# EAGLE design SkweezeeBit (EAGLE 9.5.2)
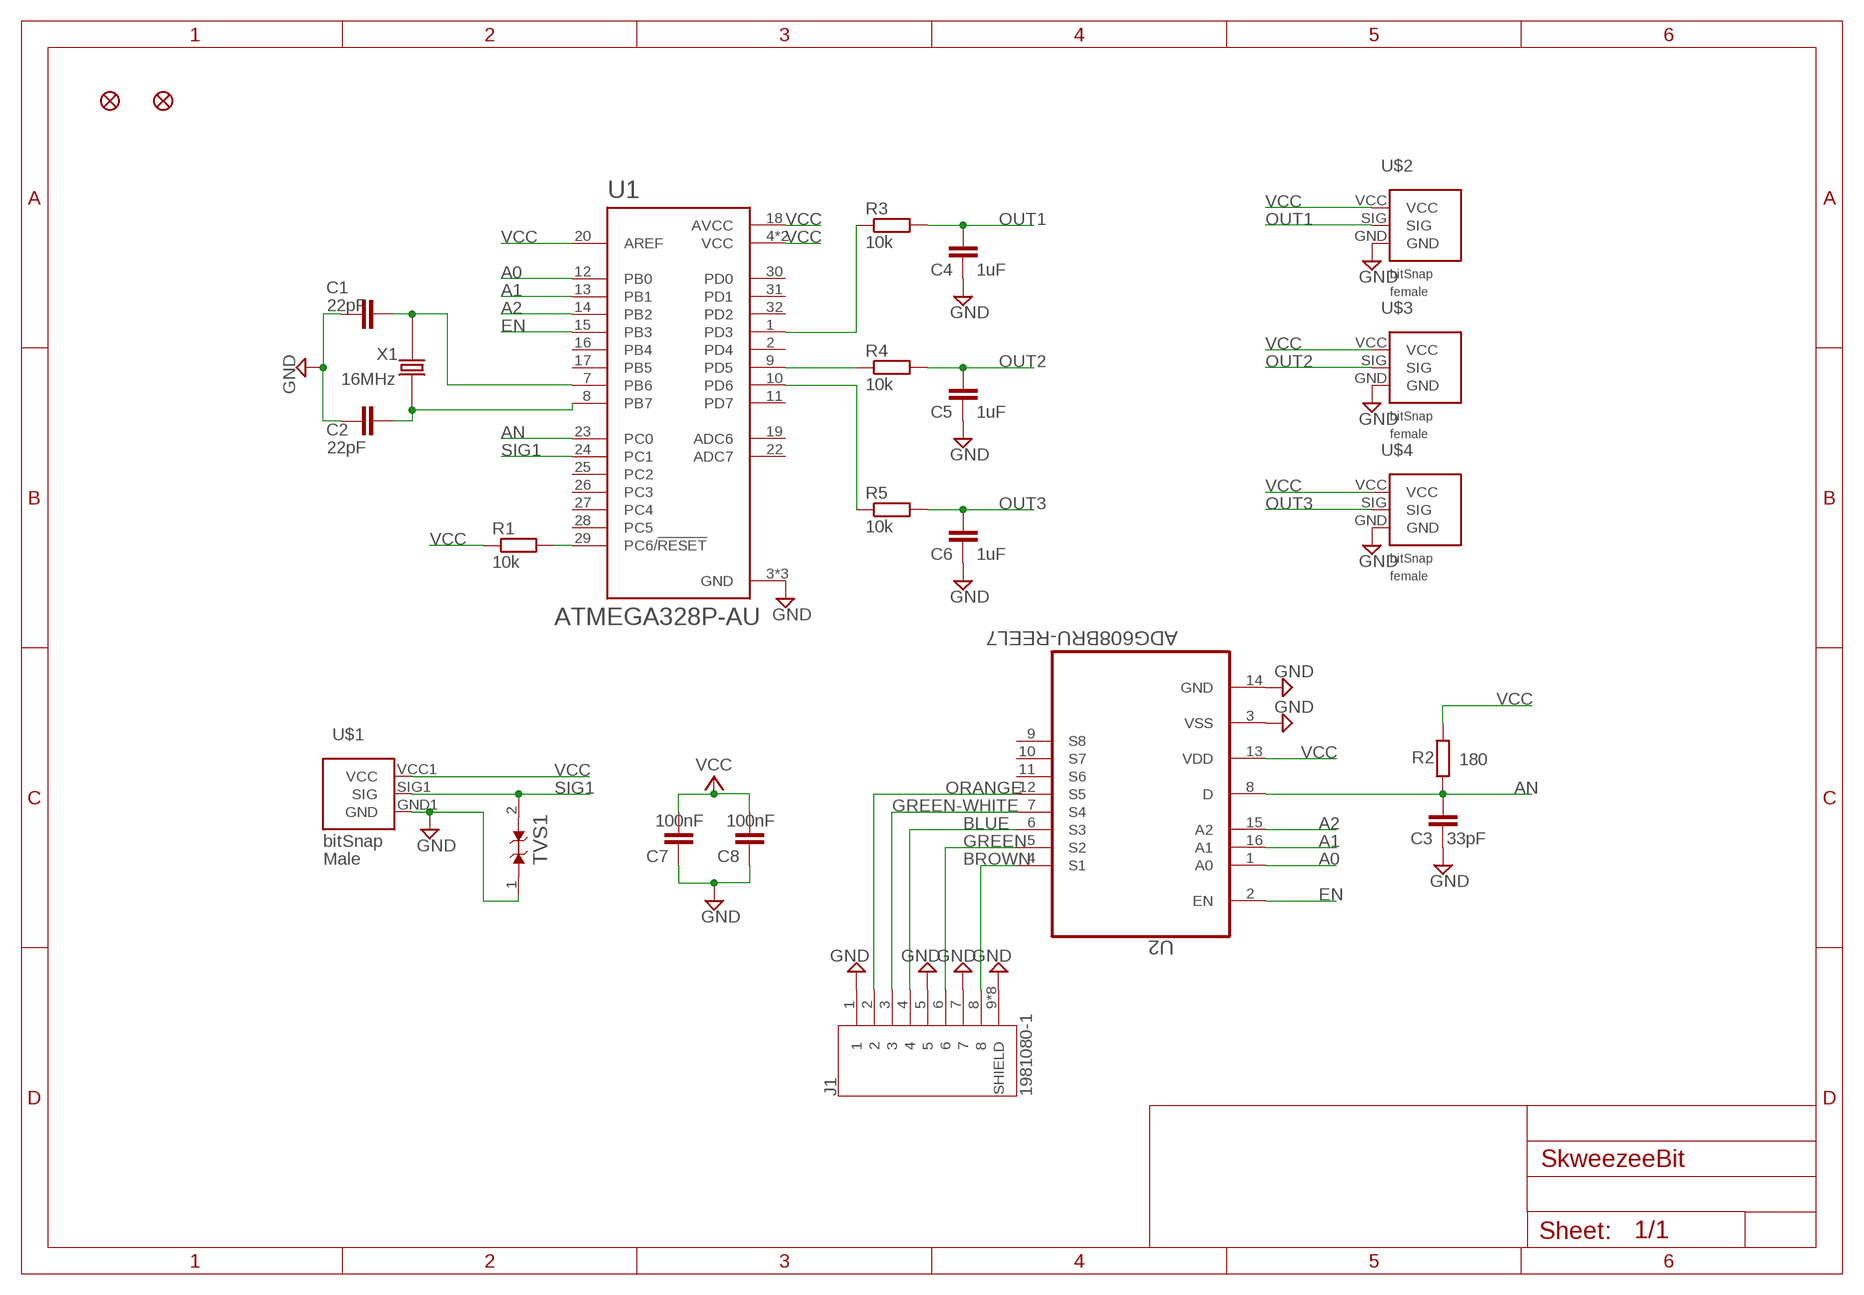
[diagram p0: schematic, sheet 1]

## Parts
C1  22pF  C-EUC0805  [C0805]
C2  22pF  C-EUC0805  [C0805]
C3  33pF  C-EUC0805  [C0805]
C4  1uF  C-EUC0805  [C0805]
C5  1uF  C-EUC0805  [C0805]
C6  1uF  C-EUC0805  [C0805]
C7  100nF  C-EUC0805  [C0805]
C8  100nF  C-EUC0805  [C0805]
J1  1981080-1  [CONN_1981080-1]
R1  10k  R-EU_R0805  [R0805]
R2  180  R-EU_R0805  [R0805]
R3  10k  R-EU_R0805  [R0805]
R4  10k  R-EU_R0805  [R0805]
R5  10k  R-EU_R0805  [R0805]
TVS1  ESD9B5.0ST5G  [SODFL1006X40N]
U1  ATMEGA328P-AU  [QFP80P900X900X120-32N]
U2  ADG608BRU-REEL7  [SOP65P640X120-16N]
U$1  BITSNAP_V03_MALE  [BITSNAP_V03_MALE]
U$2  BITSNAP_V03_FEMALE  [BITSNAP_V03_FEMALE]
U$3  BITSNAP_V03_FEMALE  [BITSNAP_V03_FEMALE]
U$4  BITSNAP_V03_FEMALE  [BITSNAP_V03_FEMALE]
U$5  FIDUCIAL  [FIDUCIAL1X2.5]
U$6  FIDUCIAL  [FIDUCIAL1X2.5]
X1  16MHz  7A-24.000MAAJ-T  [XTAL500X320X120]

## Nets
A0: U1.12(PB0) U2.1(A0)
A1: U1.13(PB1) U2.16(A1)
A2: U1.14(PB2) U2.15(A2)
AN: C3.2 R2.1 U1.23(PC0) U2.8(D)
BLUE: J1.4 U2.6(S3)
BROWN: J1.8 U2.4(S1)
EN: U1.15(PB3) U2.2(EN)
GND: C1.1 C2.1 C3.1 C4.1 C5.1 C6.1 C7.1 C8.1 J1.1 J1.5 J1.7 J1.9(SHIELD) J1.9.1(SHIELD) J1.10(SHIELD) J1.10.1(SHIELD) J1.11(SHIELD) J1.12(SHIELD) J1.13(SHIELD) J1.13.1(SHIELD) TVS1.1(A) U1.3(GND) U1.5(GND) U1.21(GND) U2.3(VSS) U2.14(GND) U$1.GND1(GND) U$2.GND U$3.GND U$4.GND
GREEN: J1.6 U2.5(S2)
GREEN-WHITE: J1.3 U2.7(S4)
N$1: C2.2 U1.8(PB7) X1.2
N$2: C1.2 U1.7(PB6) X1.1
N$5: R1.2 U1.29(PC6/!RESET)
N$9: R3.1 U1.1(PD3)
N$10: R4.1 U1.9(PD5)
N$11: R5.1 U1.10(PD6)
ORANGE: J1.2 U2.12(S5)
OUT1: C4.2 R3.2 U$2.SIG
OUT2: C5.2 R4.2 U$3.SIG
OUT3: C6.2 R5.2 U$4.SIG
SIG1: TVS1.2(A1) U1.24(PC1) U$1.SIG1(SIG)
VCC: C7.2 C8.2 R1.1 R2.2 U1.4(VCC) U1.6(VCC) U1.18(AVCC) U1.20(AREF) U2.13(VDD) U$1.VCC1(VCC) U$2.VCC U$3.VCC U$4.VCC
Unconnected: U1.2(PD4) U1.11(PD7) U1.16(PB4) U1.17(PB5) U1.19(ADC6) U1.22(ADC7) U1.25(PC2) U1.26(PC3) U1.27(PC4) U1.28(PC5) U1.30(PD0) U1.31(PD1) U1.32(PD2) U2.9(S8) U2.10(S7) U2.11(S6)

## Library data of the parts
C1-C8 = rcl:C-EU: CAPACITOR, European symbol; SPICEPREFIX: C
J1 = 1981080-1:1981080-1: 8 Position Single Port Right Angle Surface Mount Industrial Mini Jack Connector; AVAILABILITY: Unavailable; COMMENT: 1981080-1; DESCRIPTION: 8 Position Industrial Mini, Type I Header Connector Solder Surface Mount, Right Angle, Horizontal; MF: TE Connectivity; MP: 1981080-1; PACKAGE: None; PRICE: None; TE_PURCHASE_URL: https://www.te.com/usa-en/product-1981080-1.html?te_bu=Cor&te_type=disp&te_campaign=seda_glo_cor-seda-global-disp-prtnr-fy19-seda-model-bom-cta_sma-317_1&elqCampaignId=32493
R1-R5 = rcl:R-EU_: RESISTOR, European symbol; SPICEPREFIX: R
TVS1 = ESD9B5.0ST5G:ESD9B5.0ST5G: ESD9B Series 7.8 V 15 pF Surface Mount TVS Diode - SOD-923; AVAILABILITY: Unavailable; DESCRIPTION: Clamp Ipp Tvs Diode Surface Mount SOD-923; MF: ON Semiconductor; MP: ESD9B5.0ST5G; PACKAGE: SOD-923 ON Semiconductor; PRICE: None
U1 = ATMEGA328P-AU:ATMEGA328P-AU: ATmega Series 20 MHz 32 KB Flash 2 KB SRAM 8-Bit Microcontroller - TQFP-32; AVAILABILITY: Unavailable; DESCRIPTION: AVR AVR® ATmega Microcontroller IC 8-Bit 20MHz 32KB _16K x 16_ FLASH 32-TQFP _7x7_; MF: Microchip Technology; MP: ATMEGA328P-AU; PACKAGE: TQFP-32 Microchip Technology; PRICE: None
U2 = ADG608BRU-REEL7:ADG608BRU-REEL7: IC, ANALOG MULTIPLEXER, 8 X 1; AVAILABILITY: Unavailable; DESCRIPTION: 1 Circuit IC Switch 8:1 30Ohm 16-TSSOP; MF: Analog Devices; MP: ADG608BRU; PACKAGE: TSSOP-16 Analog Devices; PRICE: None
U$1 = bitSnap140813:BITSNAP_V03_MALE
U$2-U$4 = bitSnap140813:BITSNAP_V03_FEMALE
U$5 U$6 = LITTLEBITS140915:FIDUCIAL
X1 = 7A-24.000MAAJ-T:7A-24.000MAAJ-T: Crystal 24MHz 30ppm (Tol) 30ppm (Stability) 18pF FUND 50Ohm 2-Pin SMD T/R; AVAILABILITY: Unavailable; DESCRIPTION: 24MHz ±30ppm Crystal 18pF 50 Ohms 2-SMD, No Lead; MF: TXC; MP: 7A-24.000MAAJ-T; PACKAGE: SMD-2 TXC; PRICE: None

## Board
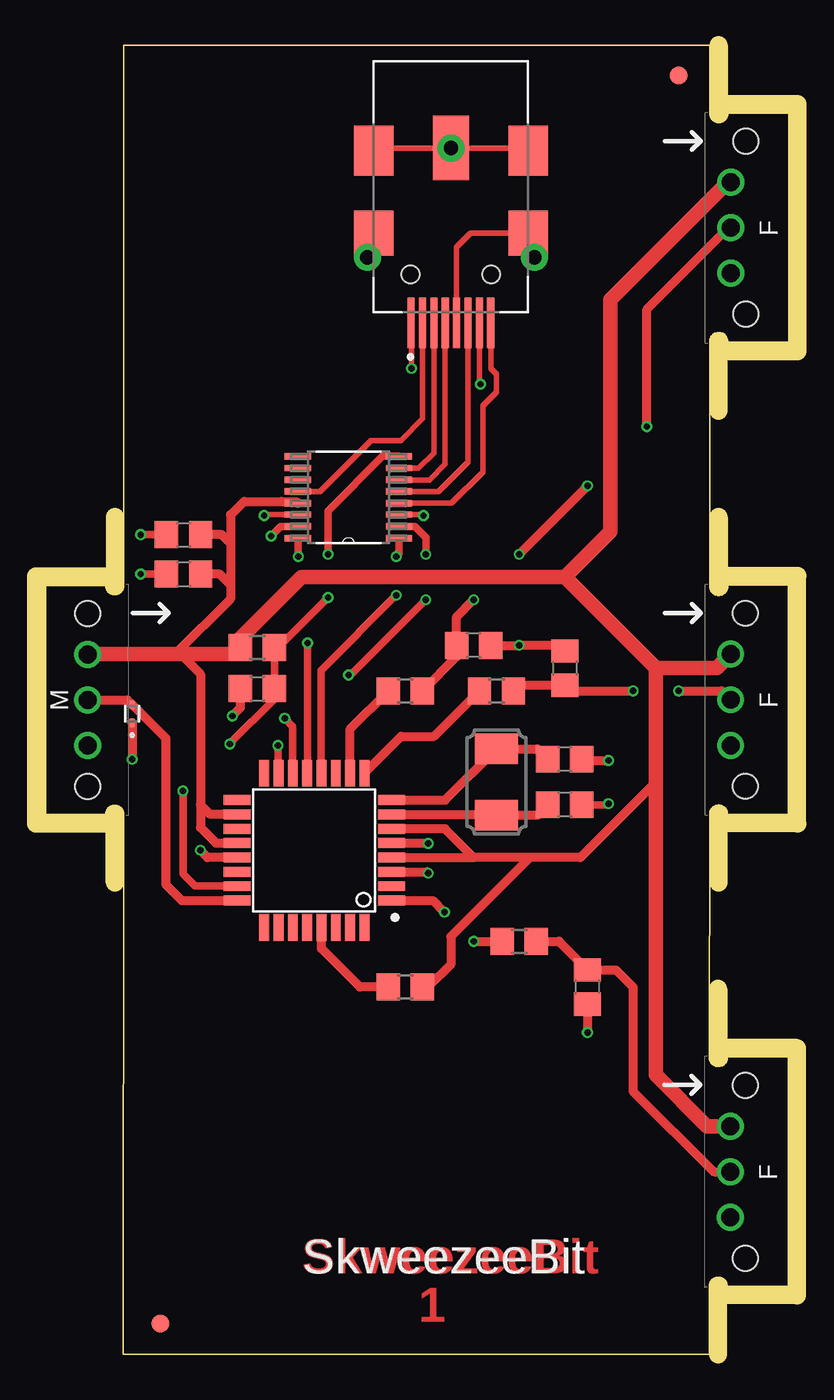
[diagram p1: board, top side]
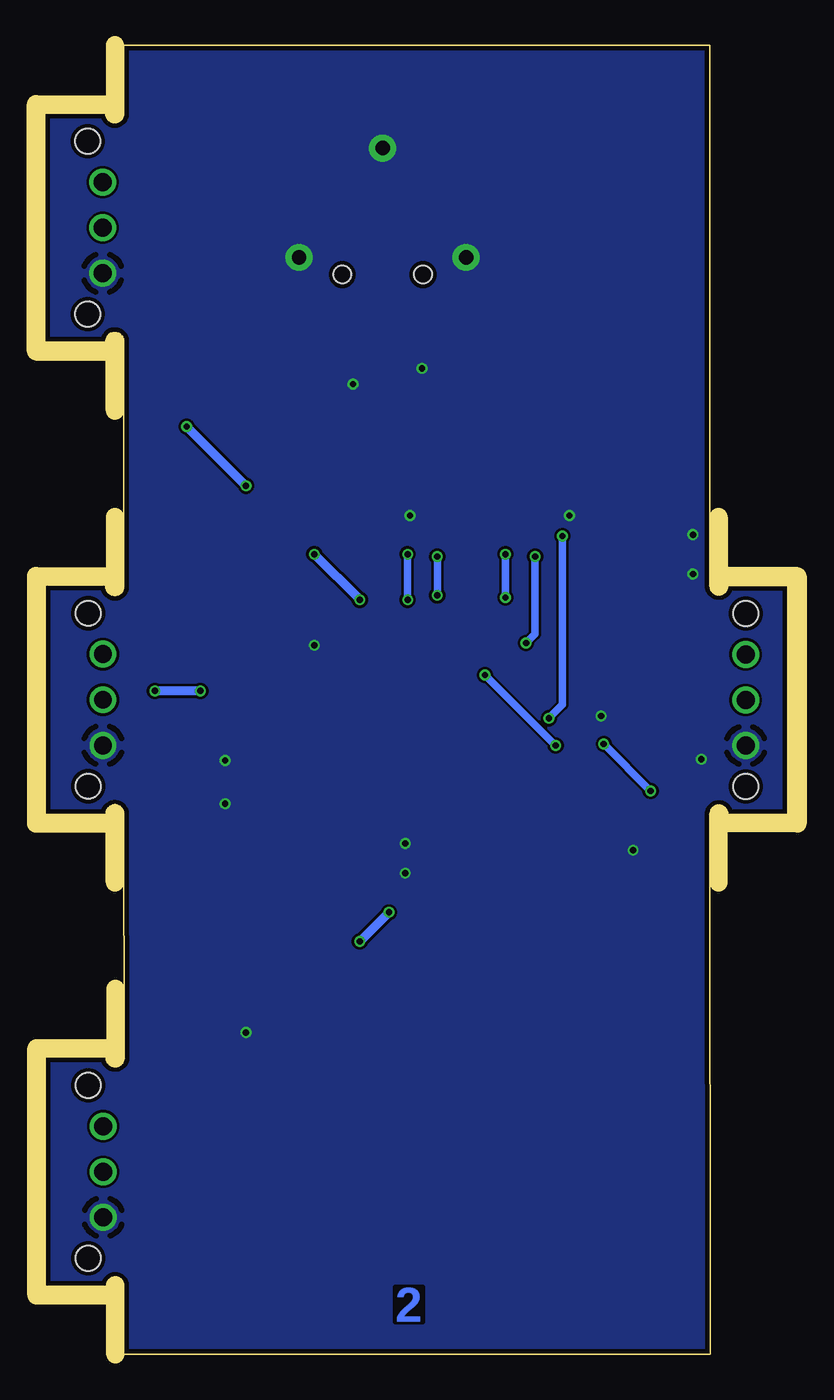
[diagram p2: board, bottom side, seen from below]

Size 41.49 x 73.04 mm. Coordinates in mm from the lower left corner, seen from the top.
Outline: 38.09,69.22 arc-180 37.09,69.17 37.09,73.02 4.39,73.02 4.39,42.88 arc-180 3.39,42.88 0.04,42.88 0.04,30.12 3.39,30.12 arc-180 4.39,30.12 4.37,0.04 37.09,0.04 37.09,3.85 arc-180 38.05,3.81 41.47,3.81 41.46,16.59 38.08,16.59 arc-180 37.06,16.57 37.09,30.16 arc-180 38.08,30.14 41.46,30.14 41.46,42.91 38.09,42.91 arc-180 37.09,42.77 37.09,56.52 arc-180 38.09,56.48 41.49,56.48 41.49,69.22 38.09,69.22
Copper layers (1*16): Top 0.018mm / dielectric 1.6mm / Bottom 0.018mm
Design rules "eC_2Layer_PClass6_BaseCopperO18_eCDefault *": minimum track width 0.15mm, minimum drill 0.35mm, track to track 0.15mm, track to pad 0.15mm, pad to pad 0.15mm, via to via 0.15mm, smd to smd 0mil, copper to edge 0.25mm, drill to drill 0.35mm, minimum pad ring 0.175mm, minimum via ring 0.125mm, stop-mask expansion 0mil, vias tented up to drill 0.45mm, thermal gap 0.2mm

### Footprints (pad centres in the part's own frame; a part is rotated, then mirrored left to right if it is on the bottom)
C0805 = smd 1.3 x 1.5: 1 -0.95,0; 2 0.95,0
CONN_1981080-1 = smd 0.4 x 2.8: 1 2.223,9.75; 2 1.587,9.75; 3 0.953,9.75; 4 0.318,9.75; 5 -0.318,9.75; 6 -0.953,9.75; 7 -1.587,9.75; 8 -2.223,9.75 | smd 2.2 x 2.5: 9 4.305,4.75; 10 -4.305,4.75 | drill 0.8 pad 1.5: 9.1 4.655,6.1; 10.1 -4.655,6.1; 13.1 0,0 | smd 2.2 x 2.8: 11 -4.305,0.15; 12 4.305,0.15 | smd 2 x 3.6: 13 0,0 | hole 1: 2.25,7.05; -2.25,7.05
R0805 = smd 1.3 x 1.5: 1 -0.95,0; 2 0.95,0
SODFL1006X40N = smd 0.5 x 0.3: 1 -0.5,0; 2 0.5,0
QFP80P900X900X120-32N = smd 1.5 x 0.55: 1 -4.3,2.8; 2 -4.3,2; 3 -4.3,1.2; 4 -4.3,0.4; 5 -4.3,-0.4; 6 -4.3,-1.2; 7 -4.3,-2; 8 -4.3,-2.8; 17 4.3,-2.8; 18 4.3,-2; 19 4.3,-1.2; 20 4.3,-0.4; 21 4.3,0.4; 22 4.3,1.2; 23 4.3,2; 24 4.3,2.8 | smd 0.55 x 1.5: 9 -2.8,-4.3; 10 -2,-4.3; 11 -1.2,-4.3; 12 -0.4,-4.3; 13 0.4,-4.3; 14 1.2,-4.3; 15 2,-4.3; 16 2.8,-4.3; 25 2.8,4.3; 26 2,4.3; 27 1.2,4.3; 28 0.4,4.3; 29 -0.4,4.3; 30 -1.2,4.3; 31 -2,4.3; 32 -2.8,4.3
SOP65P640X120-16N = smd 1.473 x 0.356: 1 -2.819,2.286; 2 -2.819,1.626; 3 -2.819,0.965; 4 -2.819,0.33; 5 -2.819,-0.33; 6 -2.819,-0.965; 7 -2.819,-1.626; 8 -2.819,-2.286; 9 2.819,-2.286; 10 2.819,-1.626; 11 2.819,-0.965; 12 2.819,-0.33; 13 2.819,0.33; 14 2.819,0.965; 15 2.819,1.626; 16 2.819,2.286
BITSNAP_V03_MALE = drill 1: GND1 9.145,2.61; SIG1 6.605,2.61; VCC1 4.065,2.61 | hole 1.4: 1.785,2.61; 11.425,2.61
BITSNAP_V03_FEMALE = drill 1: GND 4.065,3.44; SIG 6.605,3.44; VCC 9.145,3.44 | hole 1.4: 1.785,2.61; 11.425,2.61
FIDUCIAL1X2.5 = smd 1 x 1: 1 0,0
XTAL500X320X120 = smd 1.7 x 2.4: 1 -1.85,0; 2 1.85,0

### Placement (x,y rotation side)
C1  29,30.67 180 top
C2  29,33.2 180 top
C3  11.86,37.14 0 top
C4  30.27,20.51 90 top
C5  29,38.29 270 top
C6  23.92,39.55 180 top
C7  7.74,45.73 0 top
C8  7.74,43.52 0 top
J1  22.65,67.28 180 top
R1  20.11,20.51 180 top
R2  11.86,39.43 180 top
R3  26.46,23.05 0 top
R4  25.19,37.02 0 top
R5  20.11,37.02 0 top
TVS1  4.87,35.75 90 top
U1  15.03,28.12 180 top
U2  16.94,47.81 180 top
U$1  -0.21,43.12 270 top
U$2  41.67,3.6 90 top
U$3  41.69,29.92 90 top
U$4  41.7,56.23 90 top
U$5  6.44,1.73 0 top
U$6  35.34,71.32 0 top
X1  25.19,31.94 90 top

### Tracks (layer width: path | path; a pad name or v marks a point on that pad's centre or on a via)
A0  (via drill 0.35)
  Top 0.406: U2.1 19.75,44.66 v19.6,44.51 | U1.12 15.41,32.44 15.41,38.16 v19.6,42.35
  Bottom 0.406: v19.6,44.51 v19.6,42.35
A1  (via drill 0.35)
  Top 0.406: U2.16 14.12,44.53 v14.14,44.51 | v14.65,39.68 14.65,32.44 U1.13
  Bottom 0.406: v14.14,44.51 14.14,40.19 v14.65,39.68
A2  (via drill 0.35)
  Top 0.406: U2.15 13.15,46.18 v12.62,45.65 | v13.38,35.49 13.83,35.04 U1.14
  Bottom 0.406: v12.62,45.65 12.62,36.25 v13.38,35.49
AN  (via drill 0.35)
  Top 0.406: U2.8 18.84,50.1 15.79,47.05 v15.79,44.63 | v10.32,34.05 10.32,34.08 12.8,36.57 C3.2 R2.1 13,39.43 v15.79,42.22 | v7.7,31.43 7.7,26.82 8.39,26.12 U1.23
  Bottom 0.406: v15.79,44.63 v15.79,42.22 | v10.32,34.05 v7.7,31.43
BLUE
  Top 0.305: J1.4 22.33,49.65 21.46,48.77 U2.6
BROWN
  Top 0.305: J1.8 24.87,54.99 25.19,54.67 25.19,53.68 24.44,52.93 24.44,49.23 22.7,47.48 U2.4
EN  (via drill 0.35)
  Top 0.406: U2.2 20.64,46.18 21.25,45.57 v21.25,44.63 | v13,33.97 13,32.46 U1.15 | v21.25,42.09 17.06,37.9 v16.94,37.9
  Bottom 0.406: v21.25,44.63 v21.25,42.09 | v16.94,37.9 v13,33.97
GND  (via drill 0.35)
  Top 0.305: J1.12 18.5,67.28 J1.13.1 26.81,67.28 J1.11 26.96,66.04 | v24.3,54.12 24.24,54.18 J1.7 | J1.1 20.45,57.51 v20.45,55 | U2.3 21.08,46.84 v21.13,46.79 | U2.14 12.29,46.84 v12.24,46.79 | J1.9.1 18,62.19 J1.9 | J1.5 22.97,61.75 23.75,62.54 J1.10 26.96,61.54 J1.10.1
  Top 0.406: C7.1 v5.34,45.73 | C8.1 v5.34,43.52 | C1.1 31.44,30.67 v31.44,30.73
  Top 0.508: C2.1 30.02,33.13 v31.44,33.13 | U1.5 21.37,28.53 v21.38,28.51 | U1.3 21.31,26.93 v21.38,26.86 | C4.1 v30.27,17.96 | C6.1 v26.46,39.55 28.68,39.55 C5.1 | TVS1.1 v4.87,33.2 | U1.21 9.08,27.73 v8.68,28.12 | C3.1 10.91,36.07 v10.46,35.62
  pour Bottom (no thermals): -3.36,76.32 43.64,76.32 43.64,-3.18 -3.36,-3.18
GREEN
  Top 0.305: J1.6 23.6,49.78 21.96,48.14 U2.5
GREEN-WHITE
  Top 0.305: J1.3 21.7,50.29 20.85,49.44 U2.7
N$1
  Top 0.508: U1.8 22.33,30.93 X1.2 27.47,33.78 C2.2
N$2
  Top 0.508: U1.7 25.15,30.12 X1.1 27.47,30.09 C1.2
N$5
  Top 0.508: R1.2 17.57,20.51 15.43,22.65 U1.29
N$9  (via drill 0.35)
  Top 0.508: U1.1 21.64,25.33 v22.3,24.67 | v23.92,23.05 R3.1
  Bottom 0.508: v22.3,24.67 v23.92,23.05
N$10
  Top 0.508: U1.9 19.88,34.48 21.7,34.48 R4.1
N$11
  Top 0.508: U1.10 17.03,34.88 R5.1
ORANGE
  Top 0.305: J1.2 21.06,52.19 19.86,50.98 18.21,50.98 15.36,48.14 U2.12
OUT1
  Top 0.508: R3.2 28.68,23.05 C4.2 31.86,21.46 32.81,20.51 32.81,14.7 37.3,10.2 U$2.SIG
OUT2  (via drill 0.35)
  Top 0.508: R4.2 26.46,37.34 C5.2 29.32,37.02 v32.81,37.02 | v35.35,37.02 37.75,37.02 U$3.SIG
  Bottom 0.508: v32.81,37.02 v35.35,37.02
OUT3  (via drill 0.35)
  Top 0.508: R5.2 22.97,38.93 C6.2 22.97,41.15 v23.92,42.09 | v26.46,44.63 v30.27,48.45 | v33.58,51.76 33.58,58.3 38.12,62.84 U$4.SIG
  Bottom 0.508: v23.92,42.09 v26.46,44.63 | v30.27,48.45 v33.58,51.76
SIG1
  Top 0.508: U$1.SIG1 4.6,36.51 TVS1.2 6.74,34.38 6.74,26.23 7.64,25.33 U1.24
VCC
  Top 0.508: 34.08,31.94 29.87,27.73 27.06,27.73 | 27.06,27.73 23.92,27.73 | 23.92,27.73 22.32,29.33 U1.6 | 27.06,27.73 22.65,23.32 22.65,21.78 21.38,20.51 R1.1 | 7.58,39.06 8.68,37.95 8.68,30.67 | 8.68,30.67 8.68,29.4 9.55,28.53 U1.20 | U1.18 9.22,30.12 8.68,30.67 | 10.36,45.23 10.36,46.82 11.12,47.58 13.19,47.58 13.21,47.56 14.04,47.56 U2.13 | 10.36,45.23 10.36,42.93 | 10.36,42.93 10.36,42.15 7.28,39.06 | 10.36,42.93 9.76,43.52 C8.2 | 10.36,45.23 9.86,45.73 C7.2 | U1.4 23.92,27.73
  Top 0.813: 34.08,38.29 29,43.37 | 34.08,38.29 37.47,38.29 U$3.VCC | 29,43.37 14.33,43.37 10.91,39.94 R2.2 10.54,39.06 7.58,39.06 7.28,39.06 U$1.VCC1 | 29,43.37 31.54,45.91 31.54,58.84 38.09,65.38 U$4.VCC | 34.08,38.29 34.08,31.94 34.08,15.59 36.93,12.74 U$2.VCC

### Text on the board
Top: SkweezeeBit | 1
Bottom: 2
tPlace: SkweezeeBit